# EAGLE design M360B (EAGLE 6.6.0)
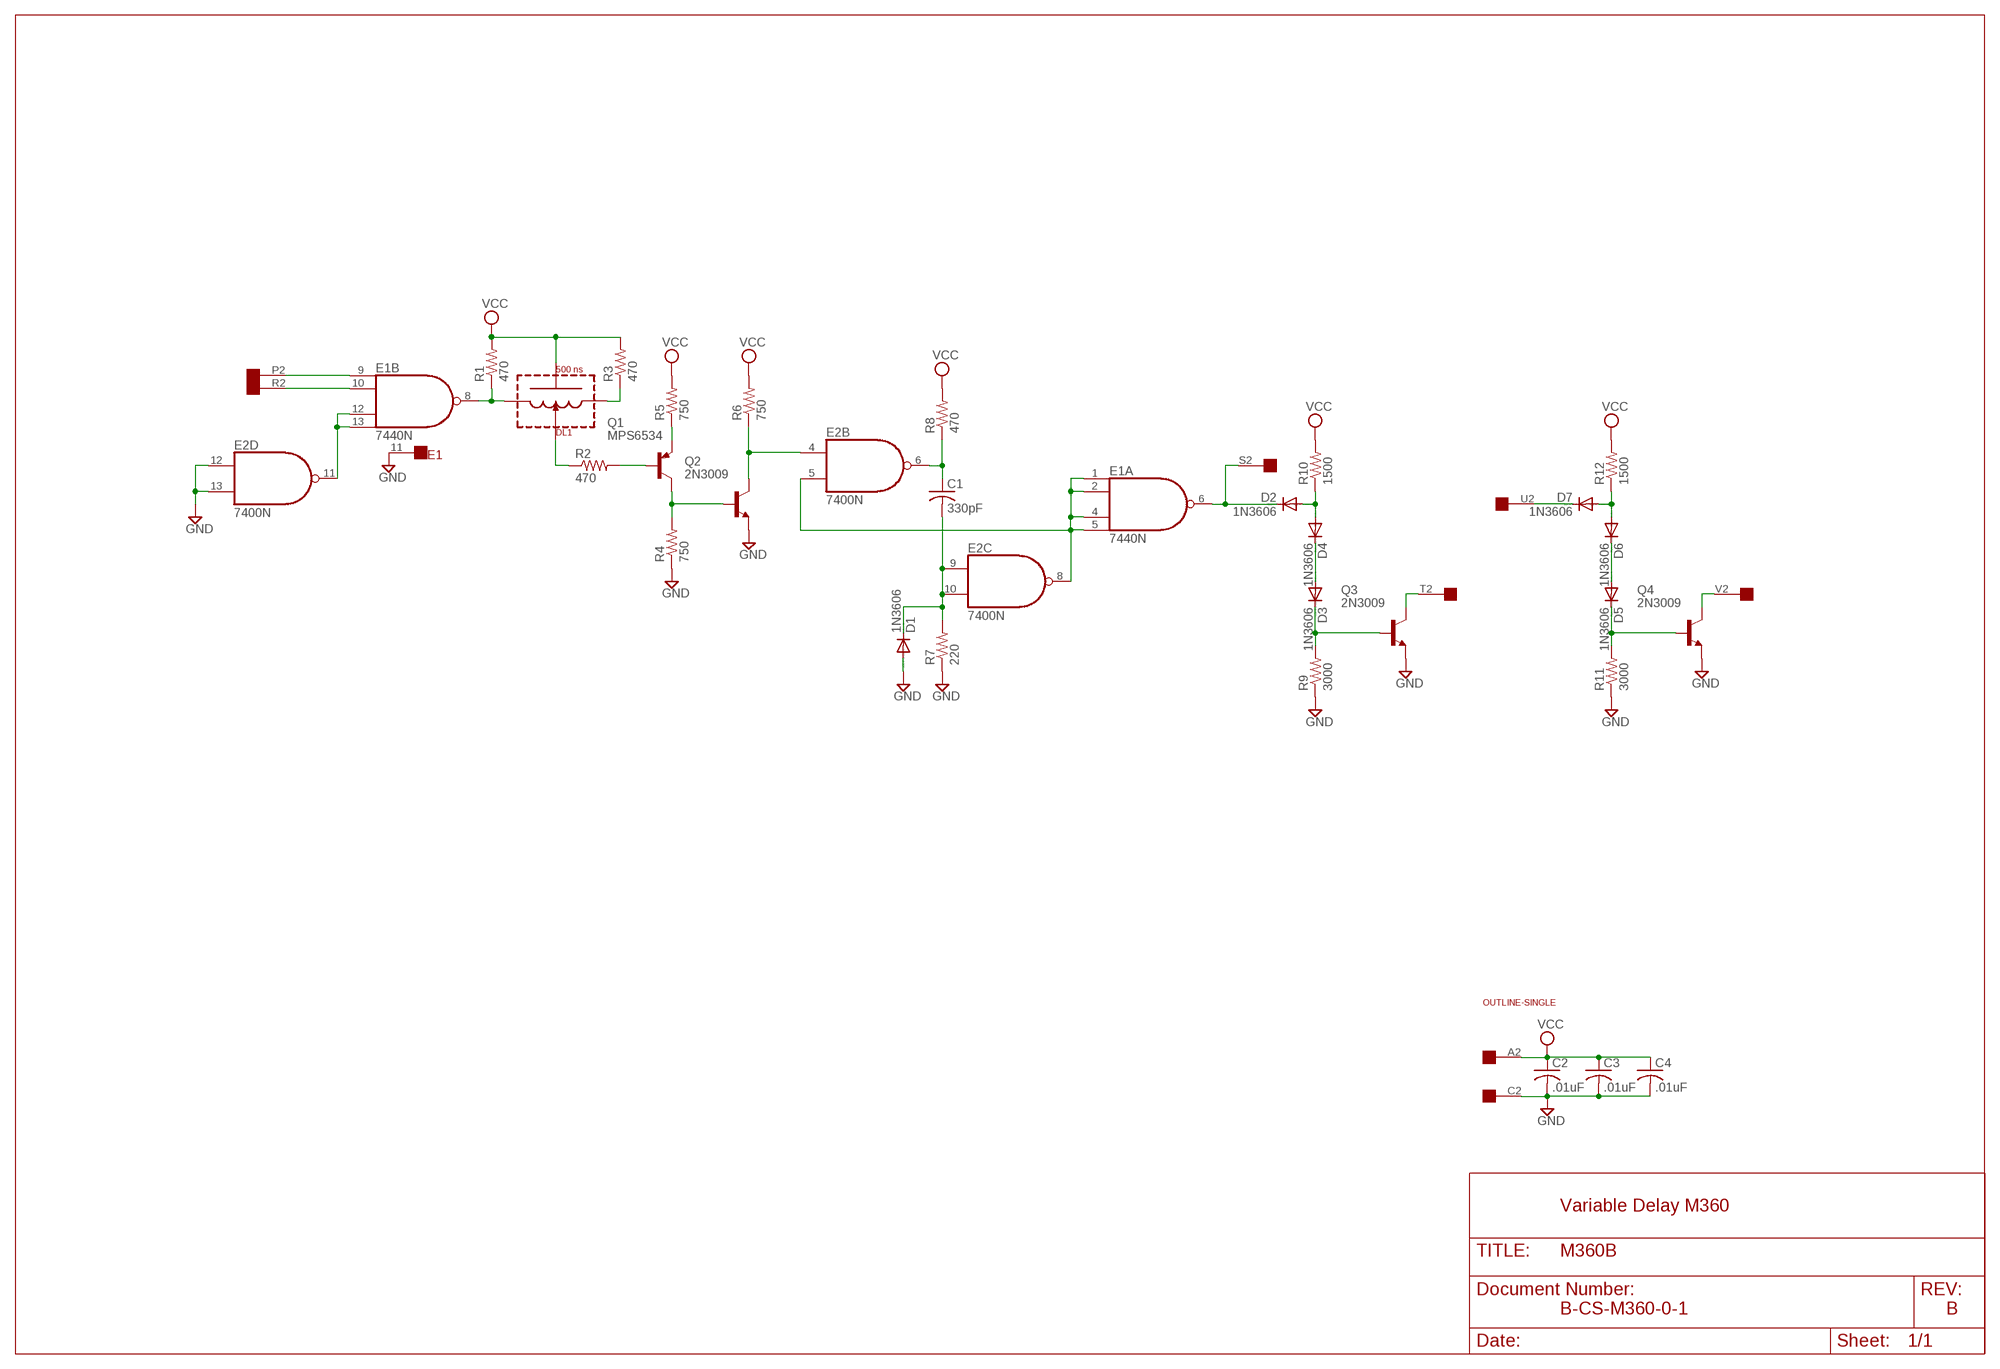
[diagram p0: schematic, sheet 1]

## Parts
C1  330pF  C-US050-025X075  [C050-025X075]
C2  .01uF  C-US050-025X075  [C050-025X075]
C3  .01uF  C-US050-025X075  [C050-025X075]
C4  .01uF  C-US050-025X075  [C050-025X075]
D1  1N3606  1N4148DO35-10  [DO35-10]
D2  1N3606  1N4148DO35-10  [DO35-10]
D3  1N3606  1N4148DO35-10  [DO35-10]
D4  1N3606  1N4148DO35-10  [DO35-10]
D5  1N3606  1N4148DO35-10  [DO35-10]
D6  1N3606  1N4148DO35-10  [DO35-10]
D7  1N3606  1N4148DO35-10  [DO35-10]
DL1  500 ns  DELAYLINE  [DELAYLINE]
E1  7440N  74S40N  [DIL14]
E2  7400N  [DIL14]
Q1  MPS6534  2N3637  [TO39]
Q2  2N3009  2N3019  [TO39]
Q3  2N3009  2N3019  [TO39]
Q4  2N3009  2N3019  [TO39]
R1  470  R-US_0207/10  [0207/10]
R2  470  R-US_0207/10  [0207/10]
R3  470  R-US_0207/10  [0207/10]
R4  750  R-US_0207/10  [0207/10]
R5  750  R-US_0207/10  [0207/10]
R6  750  R-US_0207/10  [0207/10]
R7  220  R-US_0207/10  [0207/10]
R8  470  R-US_0207/10  [0207/10]
R9  3000  R-US_0207/10  [0207/10]
R10  1500  R-US_0207/10  [0207/10]
R11  3000  R-US_0207/10  [0207/10]
R12  1500  R-US_0207/10  [0207/10]
U$1  OUTLINE-SINGLE  [SINGLE]
U$4  SINGLE  [EDGE-CON2]

## Nets
GND [power]: C2.2 C3.2 C4.2 D1.A E1.11(11:NC) E2.12(D:I0) E2.13(D:I1) Q2.1(E) Q3.1(E) Q4.1(E) R4.1 R7.1 R9.1 R11.1 U$4.C2
N$1: E1.12(B:I2) E1.13(B:I3) E2.11(D:O)
N$2: E1.10(B:I1) U$4.R2
N$3: E1.1(A:I0) E1.2(A:I1) E1.4(A:I2) E1.5(A:I3) E2.5(B:I1) E2.8(C:O)
N$4: DL1.R R3.1
N$5: DL1.L E1.8(B:O) R1.1
N$6: DL1.V R2.1
N$7: Q1.2(B) R2.2
N$8: Q1.3(C) Q2.2(B) R4.2
N$9: Q1.1(E) R5.1
N$10: E2.4(B:I0) Q2.3(C) R6.1
N$11: C1.1 E2.6(B:O) R8.1
N$12: C1.2 D1.C E2.9(C:I0) E2.10(C:I1) R7.2
N$13: D2.C E1.6(A:O) U$4.S2
N$14: D2.A D4.A R10.1
N$15: D3.A D4.C
N$16: D3.C Q3.2(B) R9.2
N$17: Q3.3(C) U$4.T2
N$18: Q4.3(C) U$4.V2
N$19: D5.C Q4.2(B) R11.2
N$20: D5.A D6.C
N$21: D7.C U$4.U2
N$22: E1.9(B:I0) U$4.P2
N$23: D6.A D7.A R12.1
VCC [power]: C2.1 C3.1 C4.1 DL1.G R1.2 R3.2 R5.2 R6.2 R8.2 R10.2 R12.2 U$4.A2
Unconnected: E1.3(3:NC) E2.1(A:I0) E2.2(A:I1) E2.3(A:O) U$4.A1 U$4.B1 U$4.B2 U$4.C1 U$4.D1 U$4.D2 U$4.E1 U$4.E2 U$4.F1 U$4.F2 U$4.H1 U$4.H2 U$4.J1 U$4.J2 U$4.K1 U$4.K2 U$4.L1 U$4.L2 U$4.M1 U$4.M2 U$4.N1 U$4.N2 U$4.P1 U$4.R1 U$4.S1 U$4.T1 U$4.U1 U$4.V1

## Notes on the sheet
- Variable Delay M360
- B-CS-M360-0-1 | B

## Power pins joined to a net without a drawn wire
GND: E1.7(P:GND) E2.7(P:GND)
VCC: E1.14(P:VCC) E2.14(P:VCC)

## Library data of the parts
C1-C4 = rcl:C-US: CAPACITOR, American symbol
D1-D7 = diode:1N4148: DIODE high speed (Philips)
DL1 = dec-con:DELAYLINE: Delay Line
E1 = dec-con:74*40: Dual 4-input NAND gate
E2 = 74xx-us:74*00: Quad 2-input NAND gate
Q1 = transistor-pnp:2N3637*: PNP Transistror
Q2-Q4 = transistor-npn:2N3019: NPN Transistor
R1-R12 = rcl:R-US_: RESISTOR, American symbol
U$1 = dec-con:OUTLINE-*: Board outlines for DEC boards.
U$4 = dec-con:SINGLE: Single-Height DEC board

## Net classes
1 power: width 0.813 mm

## Board
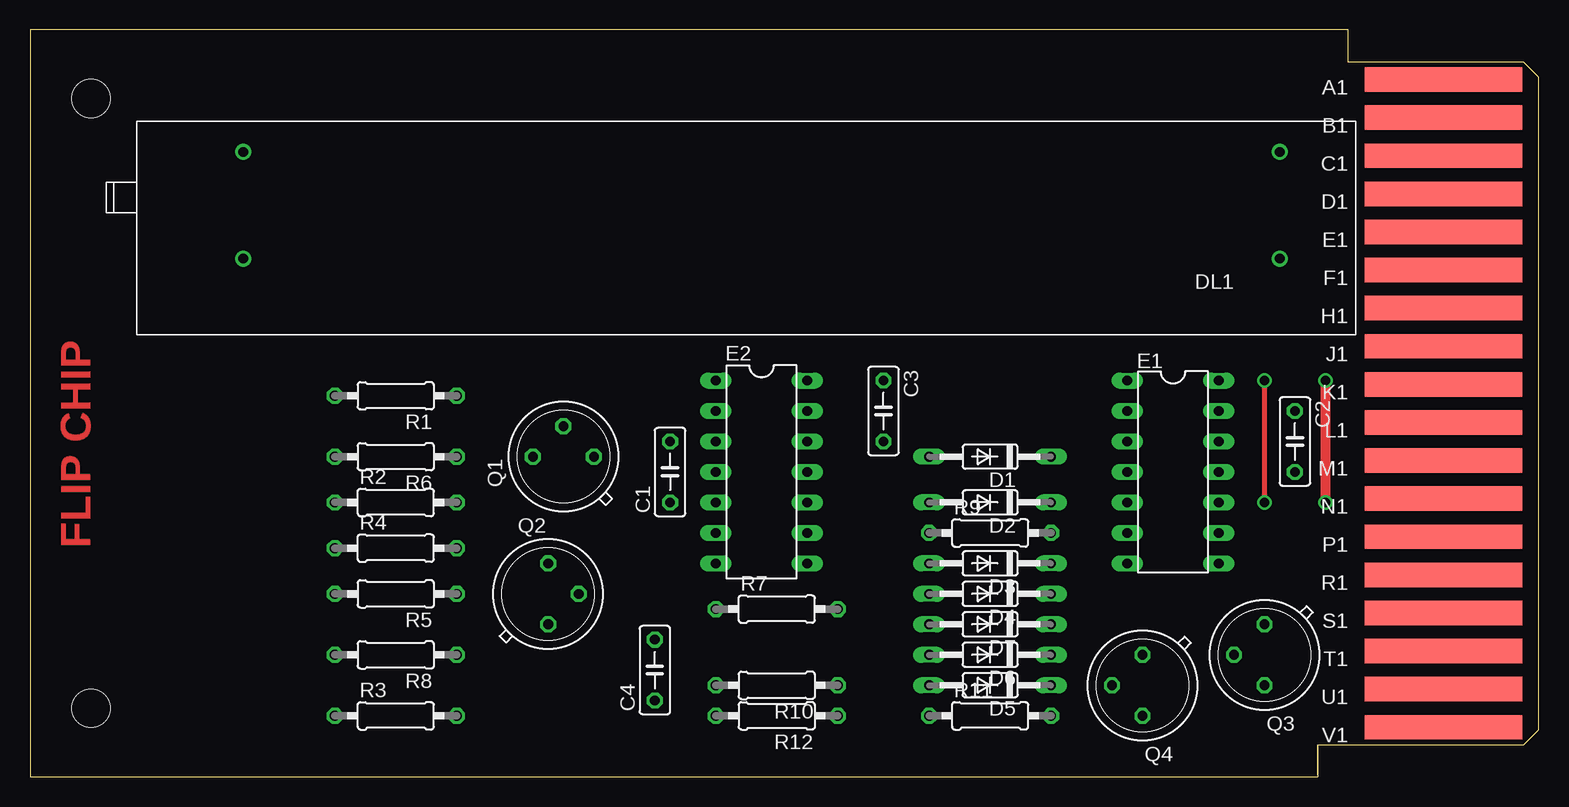
[diagram p1: board, top side]
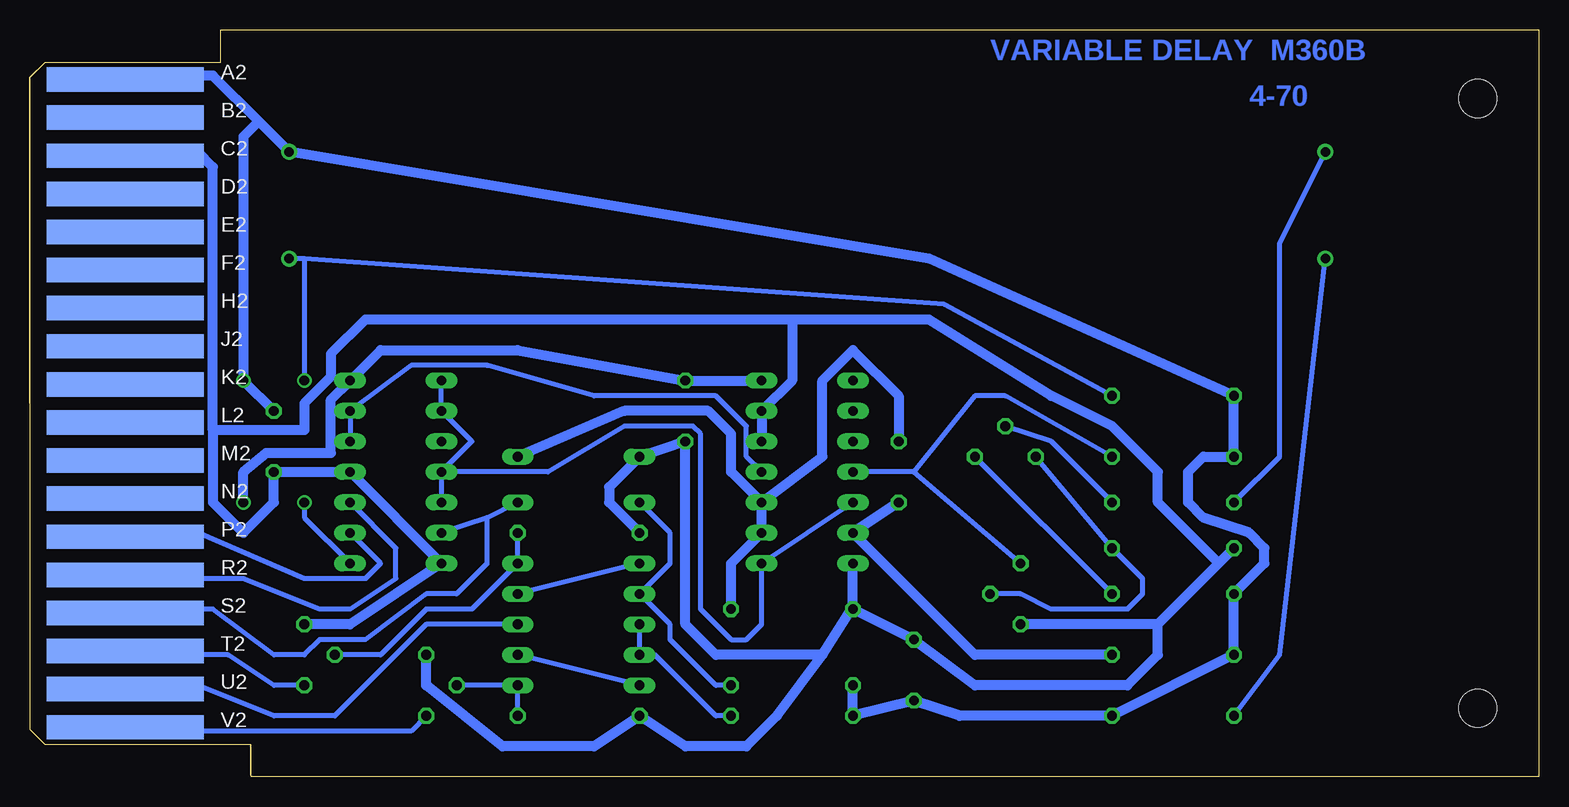
[diagram p2: board, bottom side, seen from below]

Size 125.73 x 62.23 mm. Coordinates in mm from the lower left corner, seen from the top.
Copper layers (1+16): Top 0.035mm / dielectric 1.5mm / Bottom 0.035mm
Design rules "16mils": minimum track width 16mil, minimum drill 32mil, track to track 15mil, track to pad 10mil, pad to pad 10mil, via to via 10mil, smd to smd 10mil, copper to edge 13mil, drill to drill 10mil, minimum pad ring 10mil, minimum via ring 8mil, stop-mask expansion 0mil, vias tented up to drill 0mil, thermal gap 10mil

### Footprints (pad centres in the part's own frame; a part is rotated, then mirrored left to right if it is on the bottom)
C050-025X075 = drill 0.813 octagon: 1 -2.54,0; 2 2.54,0
DO35-10 = drill 0.813 long: A 5.08,0; C -5.08,0
DELAYLINE = drill 0.813: G -44.45,-7.62; L -44.45,1.27; R 41.91,1.27; V 41.91,-7.62
DIL14 = drill 0.813 long: 1 -7.62,-3.81; 2 -5.08,-3.81; 3 -2.54,-3.81; 4 0,-3.81; 5 2.54,-3.81; 6 5.08,-3.81; 7 7.62,-3.81; 8 7.62,3.81; 9 5.08,3.81; 10 2.54,3.81; 11 0,3.81; 12 -2.54,3.81; 13 -5.08,3.81; 14 -7.62,3.81
TO39 = drill 0.813 octagon: 1 0,-2.54; 2 2.54,0; 3 0,2.54
0207/10 = drill 0.813 octagon: 1 -5.08,0; 2 5.08,0
SINGLE = hole 3.175: 120.65,56.515; 120.65,5.715
EDGE-CON2 = smd 13.106 x 2.032: A1 7.938,4.128; B1 7.938,7.303; C1 7.938,10.477; D1 7.938,13.652; E1 7.938,16.828; F1 7.938,20.003; H1 7.938,23.177; J1 7.938,26.352; K1 7.938,29.527; L1 7.938,32.703; M1 7.938,35.877; N1 7.938,39.053; P1 7.938,42.227; R1 7.938,45.403; S1 7.938,48.578; T1 7.938,51.752; U1 7.938,54.928; V1 7.938,58.102 | smd 13.106 x 2.032 bottom: A2 7.938,4.128; B2 7.938,7.303; C2 7.938,10.477; D2 7.938,13.652; E2 7.938,16.828; F2 7.938,20.003; H2 7.938,23.177; J2 7.938,26.352; K2 7.938,29.527; L2 7.938,32.703; M2 7.938,35.877; N2 7.938,39.053; P2 7.938,42.227; R2 7.938,45.403; S2 7.938,48.578; T2 7.938,51.752; U2 7.938,54.928; V2 7.938,58.102

### Placement (x,y rotation side)
C1  53.34,25.4 90 top
C2  105.41,27.94 270 top
C3  71.12,30.48 270 top
C4  52.07,8.89 90 top
D1  80.01,26.67 180 top
D2  80.01,22.86 180 top
D3  80.01,17.78 180 top
D4  80.01,15.24 180 top
D5  80.01,7.62 180 top
D6  80.01,10.16 180 top
D7  80.01,12.7 180 top
DL1  59.69,44.45 180 top
E1  95.25,25.4 270 top
E2  60.96,25.4 270 top
Q1  44.45,26.67 90 top
Q2  43.18,15.24 0 top
Q3  102.87,10.16 180 top
Q4  92.71,7.62 180 top
R1  30.48,31.75 180 top
R2  30.48,22.86 0 top
R3  30.48,5.08 0 top
R4  30.48,19.05 0 top
R5  30.48,15.24 180 top
R6  30.48,26.67 180 top
R7  62.23,13.97 0 top
R8  30.48,10.16 180 top
R9  80.01,20.32 0 top
R10  62.23,7.62 180 top
R11  80.01,5.08 0 top
R12  62.23,5.08 180 top
U$1  125.73,62.23 180 top
U$3  [FLIPCHIP]  0,0 0 top
U$4  125.73,62.23 180 top

### Tracks (layer width: path | path; a pad name or v marks a point on that pad's centre or on a via)
GND
  Bottom 0.813: 26.67,17.78 R4.1 | 31.75,12.7 26.67,17.78 | 31.75,12.7 Q2.1 | E2.12 E2.13 62.23,33.02 62.23,38.1 | 62.23,38.1 50.8,38.1 40.64,31.75 35.56,29.21 31.75,25.4 31.75,22.86 26.67,17.78 | R7.1 E2.7 | R7.1 C4.2 46.99,7.62 34.29,7.62 31.75,10.16 31.75,12.7 | R7.1 57.27,14.06 59.69,10.16 | 59.69,10.16 63.5,5.08 66.04,2.54 71.12,2.54 R11.1 78.74,2.54 86.36,2.54 92.71,7.62 Q4.1 | 59.69,10.16 68.58,10.16 71.12,12.7 C3.2 D1.A 77.47,24.13 77.47,22.86 R9.1 | U$4.C2 116.84,52.07 111.76,52.07 110.49,50.8 110.49,28.89 | 110.49,28.89 110.49,22.86 107.95,20.32 105.41,22.86 C2.2 E1.11 E1.7 99.06,12.7 Q3.1 | 62.23,38.1 97.79,38.1 100.65,35.24 100.65,33.34 102.87,31.11 102.87,28.89 110.49,28.89
N$1
  Bottom 0.406: E2.11 66.04,26.67 66.04,29.21 68.58,31.75 78.74,31.75 87.63,34.29 93.98,34.29 E1.13 E1.12
N$2
  Bottom 0.406: E1.10 95.25,19.05 95.25,16.51 99.06,13.97 101.6,13.97 107.95,16.51 116.84,16.51 U$4.R2
N$3
  Bottom 0.406: E1.4 88.9,27.94 E1.2 E1.1 | E1.4 E1.5 | E2.5 E2.8 64.77,12.7 66.04,11.43 67.31,11.43 69.85,13.97 69.85,28.57 70.48,29.21 76.2,29.21 82.55,25.4 E1.4
N$4
  Bottom 0.406: R3.1 21.59,10.16 DL1.R
N$5  (via drill 0.81)
  Top 0.406: v102.87,33.02 v102.87,22.86
  Bottom 0.406: v102.87,22.86 102.87,21.59 E1.8 | 102.87,43.18 DL1.L 102.87,43.18 | 102.87,43.18 v102.87,33.02 | R1.1 49.53,39.37 102.87,43.18
N$6
  Bottom 0.406: DL1.V 21.59,44.45 21.59,26.67 R2.1
N$7
  Bottom 0.406: R2.2 40.64,27.94 Q1.2
N$8
  Bottom 0.406: Q1.3 R4.2 33.02,16.51 33.02,15.24 34.29,13.97 40.64,13.97 43.18,15.24 Q2.2
N$9
  Bottom 0.406: R5.1 Q1.1
N$10
  Bottom 0.406: 52.07,25.4 E2.4 | 52.07,25.4 Q2.3 | R6.1 44.45,31.75 46.99,31.75 52.07,25.4
N$11
  Bottom 0.813: C1.1 E2.6 46.99,10.16 R8.1
N$12
  Bottom 0.813: C1.2 53.34,31.75 57.15,35.56 59.69,33.02 59.69,26.67 E2.10 | E2.10 E2.9 67.31,17.78 R7.2 | E2.10 67.31,25.4 67.31,28.57 69.22,30.48 76.2,30.48 D1.C
N$13
  Bottom 0.406: 87.63,21.59 E1.6 | U$4.S2 115.57,13.97 110.49,13.97 105.41,10.16 102.87,10.16 101.6,11.43 97.79,11.43 92.71,15.24 90.17,15.24 87.63,17.78 87.63,21.59 | 87.63,21.59 D2.C
N$14
  Bottom 0.406: R10.1 68.58,7.62 72.39,11.43 72.39,12.7 D4.A 72.39,17.78 72.39,20.32 D2.A
N$15
  Bottom 0.406: D3.A D4.C
N$16
  Bottom 0.406: R9.2 D3.C 88.9,13.97 92.71,13.97 96.52,10.16 Q3.2
N$17
  Bottom 0.406: U$4.T2 116.84,10.16 109.22,10.16 105.41,7.62 Q3.3
N$18
  Bottom 0.406: U$4.V2 116.84,3.81 93.98,3.81 Q4.3
N$19
  Bottom 0.406: R11.2 D5.C Q4.2
N$20
  Bottom 0.406: D5.A D6.C
N$21
  Bottom 0.406: U$4.U2 116.84,7.62 111.76,7.62 105.41,5.08 100.33,5.08 92.71,12.7 D7.C
N$22
  Bottom 0.406: U$4.P2 115.57,20.32 111.76,20.32 102.87,16.51 97.79,16.51 96.52,17.78 E1.9
N$23
  Bottom 0.406: R12.1 68.58,5.08 73.66,10.16 D6.A D7.A
VCC  (via drill 0.81)
  Top 0.813: v107.95,33.02 v107.95,22.86
  Bottom 0.813: U$4.A2 116.84,58.42 110.49,58.42 106.68,54.61 | 106.68,54.61 DL1.G 50.8,43.18 R1.2 R6.2 27.94,26.67 29.21,25.4 29.21,22.86 27.94,21.59 24.13,20.32 22.86,19.05 22.86,17.78 R5.2 R8.2 R3.2 48.26,5.08 C4.1 R12.2 R10.2 | E2.14 C3.1 85.09,35.56 96.52,35.56 E1.14 100.65,31.43 100.65,26.99 106.05,26.99 107.95,25.4 v107.95,22.86 | C2.1 v107.95,33.02 107.95,53.34 106.68,54.61

### Text on the board
Bottom: VARIABLE DELAY M360B | 4-70